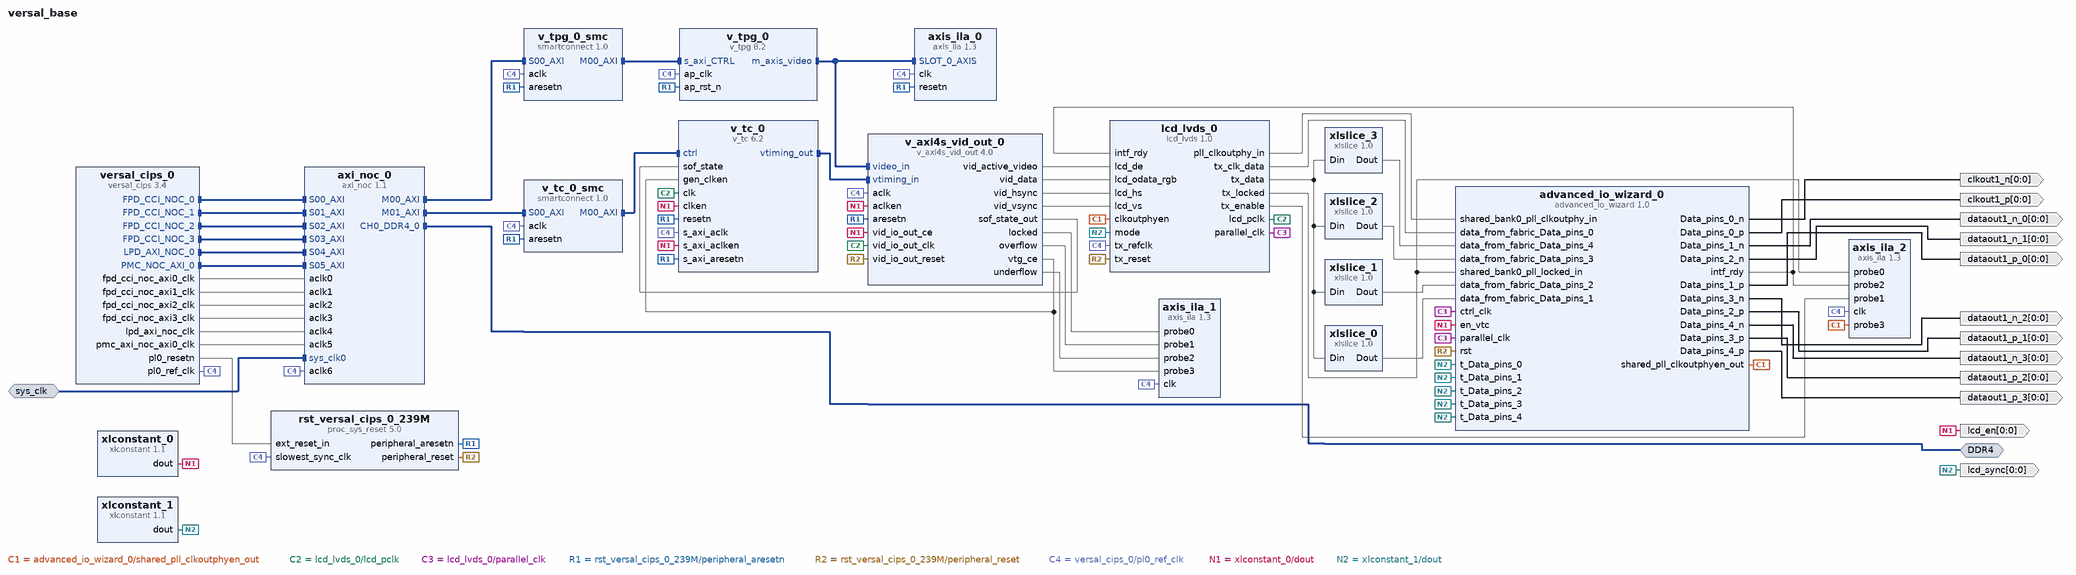
[diagram p0: block diagram of the top level]
# Vivado block design versal_base, xcve2302-sfva784-1LP-e-S, Vivado 2024.2
create_bd_design versal_base

create_bd_intf_port -mode Master -vlnv xilinx.com:interface:ddr4_rtl:1.0 DDR4
create_bd_intf_port -mode Slave -vlnv xilinx.com:interface:diff_clock_rtl:1.0 sys_clk
set_property -dict {CONFIG.FREQ_HZ 200000000} [get_bd_intf_ports sys_clk]
create_bd_port -dir O -from 0 -to 0 dataout1_n_0
create_bd_port -dir O -from 0 -to 0 dataout1_n_3
create_bd_port -dir O -from 0 -to 0 dataout1_p_0
create_bd_port -dir O -from 0 -to 0 dataout1_n_2
create_bd_port -dir O -from 0 -to 0 dataout1_p_3
create_bd_port -dir O -from 0 -to 0 dataout1_p_2
create_bd_port -dir O -from 0 -to 0 clkout1_n
create_bd_port -dir O -from 0 -to 0 clkout1_p
create_bd_port -dir O -from 0 -to 0 dataout1_n_1
create_bd_port -dir O -from 0 -to 0 dataout1_p_1
create_bd_port -dir O -from 0 -to 0 lcd_en
create_bd_port -dir O -from 0 -to 0 lcd_sync

create_bd_cell -type ip -vlnv xilinx.com:ip:versal_cips:3.4 versal_cips_0
set_property -dict [list \
  CONFIG.BOOT_MODE Custom \
  CONFIG.CLOCK_MODE Custom \
  CONFIG.DDR_MEMORY_MODE Enable \
  CONFIG.DESIGN_MODE 1 \
  CONFIG.IO_CONFIG_MODE Custom \
  CONFIG.PS_PMC_CONFIG {['BOOT_MODE Custom', 'CLOCK_MODE Custom', 'DDR_MEMORY_MODE {Connectivity to DDR via NOC}', 'IO_CONFIG_MODE Custom', 'PMC_CRP_PL0_REF_CTRL_FREQMHZ 200', 'PMC_QSPI_FBCLK {{ENABLE 1} {IO {PMC_MIO 6}}}', 'PMC_QSPI_PERIPHERAL_DATA_MODE x4', 'PMC_QSPI_PERIPHERAL_ENABLE 1', 'PMC_QSPI_PERIPHERAL_MODE {Dual Parallel}', 'PMC_SD0 {{CD_ENABLE 0} {CD_IO {PMC_MIO 24}} {POW_ENABLE 0} {POW_IO {PMC_MIO 17}} {RESET_ENABLE 1} {RESET_IO {PMC_MIO 49}} {WP_ENABLE 0} {WP_IO {PMC_MIO 25}}}', 'PMC_SD0_DATA_TRANSFER_MODE 8Bit', 'PMC_SD0_PERIPHERAL {{CLK_100_SDR_OTAP_DLY 0x00} {CLK_200_SDR_OTAP_DLY 0x2} {CLK_50_DDR_ITAP_DLY 0x1E} {CLK_50_DDR_OTAP_DLY 0x5} {CLK_50_SDR_ITAP_DLY 0x2C} {CLK_50_SDR_OTAP_DLY 0x5} {ENABLE 1} {IO {PMC_MIO 37 .. 49}}}', 'PMC_SD0_SLOT_TYPE eMMC', 'PMC_SD1 {{CD_ENABLE 1} {CD_IO {PMC_MIO 28}} {POW_ENABLE 0} {POW_IO {PMC_MIO 12}} {RESET_ENABLE 0} {RESET_IO {PMC_MIO 12}} {WP_ENABLE 0} {WP_IO {PMC_MIO 1}}}', 'PMC_SD1_PERIPHERAL {{CLK_100_SDR_OTAP_DLY 0x00} {CLK_200_SDR_OTAP_DLY 0x00} {CLK_50_DDR_ITAP_DLY 0x00} {CLK_50_DDR_OTAP_DLY 0x00} {CLK_50_SDR_ITAP_DLY 0x2C} {CLK_50_SDR_OTAP_DLY 0x4} {ENABLE 1} {IO {PMC_MIO 26 .. 36}}}', 'PMC_USE_PMC_NOC_AXI0 1', 'PS_ENET0_MDIO {{ENABLE 1} {IO {PMC_MIO 50 .. 51}}}', 'PS_ENET0_PERIPHERAL {{ENABLE 1} {IO {PS_MIO 0 .. 11}}}', 'PS_GEN_IPI0_ENABLE 1', 'PS_GEN_IPI1_ENABLE 1', 'PS_GEN_IPI2_ENABLE 1', 'PS_GEN_IPI3_ENABLE 1', 'PS_GEN_IPI4_ENABLE 1', 'PS_GEN_IPI5_ENABLE 1', 'PS_GEN_IPI6_ENABLE 1', 'PS_GPIO_EMIO_PERIPHERAL_ENABLE 1', 'PS_MIO24 {{AUX_IO 0} {DIRECTION in} {DRIVE_STRENGTH 8mA} {OUTPUT_DATA default} {PULL pullup} {SCHMITT 0} {SLEW slow} {USAGE GPIO}}', 'PS_MIO25 {{AUX_IO 0} {DIRECTION out} {DRIVE_STRENGTH 8mA} {OUTPUT_DATA default} {PULL pullup} {SCHMITT 0} {SLEW slow} {USAGE GPIO}}', 'PS_NUM_FABRIC_RESETS 1', 'PS_TTC0_PERIPHERAL_ENABLE 1', 'PS_TTC1_PERIPHERAL_ENABLE 1', 'PS_TTC2_PERIPHERAL_ENABLE 1', 'PS_TTC3_PERIPHERAL_ENABLE 1', 'PS_UART0_PERIPHERAL {{ENABLE 1} {IO {PS_MIO 16 .. 17}}}', 'PS_USB3_PERIPHERAL {{ENABLE 1} {IO {PMC_MIO 13 .. 25}}}', 'PS_USE_FPD_CCI_NOC 1', 'PS_USE_FPD_CCI_NOC0 1', 'PS_USE_NOC_LPD_AXI0 1', 'PS_USE_PMCPL_CLK0 1', 'SMON_ALARMS Set_Alarms_On', 'SMON_ENABLE_TEMP_AVERAGING 0', 'SMON_TEMP_AVERAGING_SAMPLES 0']} \
] [get_bd_cells versal_cips_0]
create_bd_cell -type ip -vlnv xilinx.com:ip:axi_noc:1.1 axi_noc_0
set_property -dict [list \
  CONFIG.CONTROLLERTYPE DDR4_SDRAM \
  CONFIG.MC_CHAN_REGION1 NONE \
  CONFIG.MC_COMPONENT_WIDTH x16 \
  CONFIG.MC_INPUTCLK0_PERIOD 5000 \
  CONFIG.MC_MEMORY_SPEEDGRADE {DDR4-3200AA(22-22-22)} \
  CONFIG.MI_SIDEBAND_PINS 0 \
  CONFIG.NUM_CLKS 7 \
  CONFIG.NUM_MC 1 \
  CONFIG.NUM_MCP 4 \
  CONFIG.NUM_MI 2 \
  CONFIG.NUM_SI 6 \
] [get_bd_cells axi_noc_0]
create_bd_cell -type ip -vlnv xilinx.com:ip:v_tpg:8.2 v_tpg_0
create_bd_cell -type ip -vlnv xilinx.com:ip:smartconnect:1.0 v_tpg_0_smc
set_property -dict {CONFIG.NUM_MI 1 CONFIG.NUM_SI 1} [get_bd_cells v_tpg_0_smc]
create_bd_cell -type ip -vlnv xilinx.com:ip:proc_sys_reset:5.0 rst_versal_cips_0_239M
create_bd_cell -type ip -vlnv xilinx.com:ip:axis_ila:1.3 axis_ila_0
set_property -dict [list \
  CONFIG.C_MON_TYPE Interface_Monitor \
  CONFIG.C_SLOT_0_INTF_TYPE xilinx.com:interface:axis_rtl:1.0 \
] [get_bd_cells axis_ila_0]
create_bd_cell -type ip -vlnv xilinx.com:ip:v_axi4s_vid_out:4.0 v_axi4s_vid_out_0
set_property -dict {CONFIG.C_HAS_ASYNC_CLK 1 CONFIG.C_VTG_MASTER_SLAVE 1} [get_bd_cells v_axi4s_vid_out_0]
create_bd_cell -type ip -vlnv xilinx.com:ip:v_tc:6.2 v_tc_0
set_property -dict {CONFIG.enable_detection false} [get_bd_cells v_tc_0]
create_bd_cell -type ip -vlnv xilinx.com:ip:xlconstant:1.1 xlconstant_0
create_bd_cell -type ip -vlnv xilinx.com:ip:axis_ila:1.3 axis_ila_1
set_property -dict {CONFIG.C_NUM_OF_PROBES 4} [get_bd_cells axis_ila_1]
create_bd_cell -type ip -vlnv xilinx.com:ip:smartconnect:1.0 v_tc_0_smc
set_property -dict {CONFIG.NUM_MI 1 CONFIG.NUM_SI 1} [get_bd_cells v_tc_0_smc]
create_bd_cell -type ip -vlnv user.org:user:lcd_lvds:1.0 lcd_lvds_0
create_bd_cell -type ip -vlnv xilinx.com:ip:xlconstant:1.1 xlconstant_1
set_property -dict {CONFIG.CONST_VAL 0} [get_bd_cells xlconstant_1]
create_bd_cell -type ip -vlnv xilinx.com:ip:advanced_io_wizard:1.0 advanced_io_wizard_0
set_property -dict [list \
  CONFIG.BUS0_IO_TYPE DIFF \
  CONFIG.BUS0_SIG_TYPE {Clk Fwd} \
  CONFIG.BUS1_DIR TX \
  CONFIG.BUS1_IO_TYPE DIFF \
  CONFIG.BUS2_DIR TX \
  CONFIG.BUS2_IO_TYPE DIFF \
  CONFIG.BUS3_DIR TX \
  CONFIG.BUS3_IO_TYPE DIFF \
  CONFIG.BUS4_DIR TX \
  CONFIG.BUS4_IO_TYPE DIFF \
  CONFIG.BUS_DIR 0 \
  CONFIG.DATA_SPEED 700.00 \
  CONFIG.DIFF_IO_STD DIFF_SSTL12 \
  CONFIG.INPUT_CLK_FREQ 200.000 \
  CONFIG.PLL_IN_CORE 0 \
  CONFIG.TX_SERIALIZATION_FACTOR 4 \
] [get_bd_cells advanced_io_wizard_0]
create_bd_cell -type ip -vlnv xilinx.com:ip:xlslice:1.0 xlslice_0
set_property -dict {CONFIG.DIN_FROM 3 CONFIG.DIN_WIDTH 16} [get_bd_cells xlslice_0]
create_bd_cell -type ip -vlnv xilinx.com:ip:xlslice:1.0 xlslice_1
set_property -dict {CONFIG.DIN_FROM 7 CONFIG.DIN_TO 4 CONFIG.DIN_WIDTH 16} [get_bd_cells xlslice_1]
create_bd_cell -type ip -vlnv xilinx.com:ip:xlslice:1.0 xlslice_2
set_property -dict {CONFIG.DIN_FROM 11 CONFIG.DIN_TO 8 CONFIG.DIN_WIDTH 16} [get_bd_cells xlslice_2]
create_bd_cell -type ip -vlnv xilinx.com:ip:xlslice:1.0 xlslice_3
set_property -dict {CONFIG.DIN_FROM 15 CONFIG.DIN_TO 12 CONFIG.DIN_WIDTH 16} [get_bd_cells xlslice_3]
create_bd_cell -type ip -vlnv xilinx.com:ip:axis_ila:1.3 axis_ila_2
set_property -dict {CONFIG.C_NUM_OF_PROBES 4} [get_bd_cells axis_ila_2]

# ---- connections ----

connect_bd_intf_net [get_bd_intf_ports DDR4] [get_bd_intf_pins axi_noc_0/CH0_DDR4_0]
connect_bd_intf_net [get_bd_intf_pins v_tpg_0_smc/S00_AXI] [get_bd_intf_pins axi_noc_0/M00_AXI]
connect_bd_intf_net [get_bd_intf_pins v_tc_0_smc/S00_AXI] [get_bd_intf_pins axi_noc_0/M01_AXI]
connect_bd_intf_net -intf_net sys_clk0_0_1 [get_bd_intf_ports sys_clk] [get_bd_intf_pins axi_noc_0/sys_clk0]
connect_bd_intf_net [get_bd_intf_pins v_tc_0/ctrl] [get_bd_intf_pins v_tc_0_smc/M00_AXI]
connect_bd_intf_net [get_bd_intf_pins v_tc_0/vtiming_out] [get_bd_intf_pins v_axi4s_vid_out_0/vtiming_in]
connect_bd_intf_net [get_bd_intf_pins v_tpg_0/m_axis_video] [get_bd_intf_pins v_axi4s_vid_out_0/video_in]
connect_bd_intf_net [get_bd_intf_pins v_tpg_0/m_axis_video] [get_bd_intf_pins axis_ila_0/SLOT_0_AXIS]
connect_bd_intf_net [get_bd_intf_pins v_tpg_0/s_axi_CTRL] [get_bd_intf_pins v_tpg_0_smc/M00_AXI]
connect_bd_intf_net [get_bd_intf_pins versal_cips_0/FPD_CCI_NOC_0] [get_bd_intf_pins axi_noc_0/S00_AXI]
connect_bd_intf_net [get_bd_intf_pins versal_cips_0/FPD_CCI_NOC_1] [get_bd_intf_pins axi_noc_0/S01_AXI]
connect_bd_intf_net [get_bd_intf_pins versal_cips_0/FPD_CCI_NOC_2] [get_bd_intf_pins axi_noc_0/S02_AXI]
connect_bd_intf_net [get_bd_intf_pins versal_cips_0/FPD_CCI_NOC_3] [get_bd_intf_pins axi_noc_0/S03_AXI]
connect_bd_intf_net [get_bd_intf_pins versal_cips_0/LPD_AXI_NOC_0] [get_bd_intf_pins axi_noc_0/S04_AXI]
connect_bd_intf_net [get_bd_intf_pins versal_cips_0/PMC_NOC_AXI_0] [get_bd_intf_pins axi_noc_0/S05_AXI]
connect_bd_net [get_bd_pins advanced_io_wizard_0/Data_pins_0_n] [get_bd_ports clkout1_n]
connect_bd_net [get_bd_pins advanced_io_wizard_0/Data_pins_0_p] [get_bd_ports clkout1_p]
connect_bd_net [get_bd_pins advanced_io_wizard_0/Data_pins_1_n] [get_bd_ports dataout1_n_0]
connect_bd_net [get_bd_pins advanced_io_wizard_0/Data_pins_1_p] [get_bd_ports dataout1_p_0]
connect_bd_net [get_bd_pins advanced_io_wizard_0/Data_pins_2_n] [get_bd_ports dataout1_n_1]
connect_bd_net [get_bd_pins advanced_io_wizard_0/Data_pins_2_p] [get_bd_ports dataout1_p_1]
connect_bd_net [get_bd_pins advanced_io_wizard_0/Data_pins_3_n] [get_bd_ports dataout1_n_2]
connect_bd_net [get_bd_pins advanced_io_wizard_0/Data_pins_3_p] [get_bd_ports dataout1_p_2]
connect_bd_net [get_bd_pins advanced_io_wizard_0/Data_pins_4_n] [get_bd_ports dataout1_n_3]
connect_bd_net [get_bd_pins advanced_io_wizard_0/Data_pins_4_p] [get_bd_ports dataout1_p_3]
connect_bd_net [get_bd_pins advanced_io_wizard_0/intf_rdy] [get_bd_pins lcd_lvds_0/intf_rdy] [get_bd_pins axis_ila_2/probe2]
connect_bd_net [get_bd_pins advanced_io_wizard_0/shared_pll_clkoutphyen_out] [get_bd_pins lcd_lvds_0/clkoutphyen] [get_bd_pins axis_ila_2/probe3]
connect_bd_net [get_bd_pins lcd_lvds_0/lcd_pclk] [get_bd_pins v_axi4s_vid_out_0/vid_io_out_clk] [get_bd_pins v_tc_0/clk]
connect_bd_net [get_bd_pins lcd_lvds_0/parallel_clk] [get_bd_pins advanced_io_wizard_0/ctrl_clk] [get_bd_pins advanced_io_wizard_0/parallel_clk]
connect_bd_net [get_bd_pins lcd_lvds_0/pll_clkoutphy_in] [get_bd_pins advanced_io_wizard_0/shared_bank0_pll_clkoutphy_in]
connect_bd_net [get_bd_pins lcd_lvds_0/tx_clk_data] [get_bd_pins advanced_io_wizard_0/data_from_fabric_Data_pins_0]
connect_bd_net [get_bd_pins lcd_lvds_0/tx_data] \
  [get_bd_pins xlslice_0/Din] [get_bd_pins xlslice_1/Din] [get_bd_pins xlslice_2/Din] [get_bd_pins xlslice_3/Din]
connect_bd_net [get_bd_pins lcd_lvds_0/tx_enable] [get_bd_pins axis_ila_2/probe1]
connect_bd_net [get_bd_pins lcd_lvds_0/tx_locked] [get_bd_pins advanced_io_wizard_0/shared_bank0_pll_locked_in] [get_bd_pins axis_ila_2/probe0]
connect_bd_net [get_bd_pins rst_versal_cips_0_239M/peripheral_aresetn] \
  [get_bd_pins v_tpg_0/ap_rst_n] [get_bd_pins v_tpg_0_smc/aresetn] [get_bd_pins axis_ila_0/resetn] \
  [get_bd_pins v_tc_0/s_axi_aresetn] [get_bd_pins v_axi4s_vid_out_0/aresetn] [get_bd_pins v_tc_0_smc/aresetn] \
  [get_bd_pins v_tc_0/resetn]
connect_bd_net [get_bd_pins rst_versal_cips_0_239M/peripheral_reset] \
  [get_bd_pins v_axi4s_vid_out_0/vid_io_out_reset] [get_bd_pins lcd_lvds_0/tx_reset] [get_bd_pins advanced_io_wizard_0/rst]
connect_bd_net [get_bd_pins v_axi4s_vid_out_0/locked] [get_bd_pins axis_ila_1/probe0]
connect_bd_net [get_bd_pins v_axi4s_vid_out_0/overflow] [get_bd_pins axis_ila_1/probe1]
connect_bd_net [get_bd_pins v_axi4s_vid_out_0/sof_state_out] [get_bd_pins v_tc_0/sof_state]
connect_bd_net [get_bd_pins v_axi4s_vid_out_0/underflow] [get_bd_pins axis_ila_1/probe2]
connect_bd_net [get_bd_pins v_axi4s_vid_out_0/vid_active_video] [get_bd_pins lcd_lvds_0/lcd_de]
connect_bd_net [get_bd_pins v_axi4s_vid_out_0/vid_data] [get_bd_pins lcd_lvds_0/lcd_odata_rgb]
connect_bd_net [get_bd_pins v_axi4s_vid_out_0/vid_hsync] [get_bd_pins lcd_lvds_0/lcd_hs]
connect_bd_net [get_bd_pins v_axi4s_vid_out_0/vid_vsync] [get_bd_pins lcd_lvds_0/lcd_vs]
connect_bd_net [get_bd_pins v_axi4s_vid_out_0/vtg_ce] [get_bd_pins axis_ila_1/probe3] [get_bd_pins v_tc_0/gen_clken]
connect_bd_net [get_bd_pins versal_cips_0/fpd_cci_noc_axi0_clk] [get_bd_pins axi_noc_0/aclk0]
connect_bd_net [get_bd_pins versal_cips_0/fpd_cci_noc_axi1_clk] [get_bd_pins axi_noc_0/aclk1]
connect_bd_net [get_bd_pins versal_cips_0/fpd_cci_noc_axi2_clk] [get_bd_pins axi_noc_0/aclk2]
connect_bd_net [get_bd_pins versal_cips_0/fpd_cci_noc_axi3_clk] [get_bd_pins axi_noc_0/aclk3]
connect_bd_net [get_bd_pins versal_cips_0/lpd_axi_noc_clk] [get_bd_pins axi_noc_0/aclk4]
connect_bd_net [get_bd_pins versal_cips_0/pl0_ref_clk] \
  [get_bd_pins v_tpg_0/ap_clk] [get_bd_pins axi_noc_0/aclk6] [get_bd_pins rst_versal_cips_0_239M/slowest_sync_clk] \
  [get_bd_pins v_tpg_0_smc/aclk] [get_bd_pins axis_ila_0/clk] [get_bd_pins v_tc_0/s_axi_aclk] \
  [get_bd_pins v_axi4s_vid_out_0/aclk] [get_bd_pins axis_ila_1/clk] [get_bd_pins v_tc_0_smc/aclk] \
  [get_bd_pins lcd_lvds_0/tx_refclk] [get_bd_pins axis_ila_2/clk]
connect_bd_net [get_bd_pins versal_cips_0/pl0_resetn] [get_bd_pins rst_versal_cips_0_239M/ext_reset_in]
connect_bd_net [get_bd_pins versal_cips_0/pmc_axi_noc_axi0_clk] [get_bd_pins axi_noc_0/aclk5]
connect_bd_net [get_bd_pins xlconstant_0/dout] \
  [get_bd_pins v_tc_0/clken] [get_bd_pins v_tc_0/s_axi_aclken] [get_bd_pins v_axi4s_vid_out_0/aclken] \
  [get_bd_pins v_axi4s_vid_out_0/vid_io_out_ce] [get_bd_pins advanced_io_wizard_0/en_vtc] [get_bd_ports lcd_en]
connect_bd_net [get_bd_pins xlconstant_1/dout] \
  [get_bd_pins lcd_lvds_0/mode] [get_bd_pins advanced_io_wizard_0/t_Data_pins_0] \
  [get_bd_pins advanced_io_wizard_0/t_Data_pins_1] [get_bd_pins advanced_io_wizard_0/t_Data_pins_2] \
  [get_bd_pins advanced_io_wizard_0/t_Data_pins_3] [get_bd_pins advanced_io_wizard_0/t_Data_pins_4] [get_bd_ports lcd_sync]
connect_bd_net [get_bd_pins xlslice_0/Dout] [get_bd_pins advanced_io_wizard_0/data_from_fabric_Data_pins_1]
connect_bd_net [get_bd_pins xlslice_1/Dout] [get_bd_pins advanced_io_wizard_0/data_from_fabric_Data_pins_2]
connect_bd_net [get_bd_pins xlslice_2/Dout] [get_bd_pins advanced_io_wizard_0/data_from_fabric_Data_pins_3]
connect_bd_net [get_bd_pins xlslice_3/Dout] [get_bd_pins advanced_io_wizard_0/data_from_fabric_Data_pins_4]

# ---- address map ----
assign_bd_address -offset 0x0000000000000000 -range 2G -target_address_space [get_bd_addr_spaces versal_cips_0/FPD_CCI_NOC_0] [get_bd_addr_segs axi_noc_0/S00_AXI/C3_DDR_LOW0]
assign_bd_address -offset 0x0000020100000000 -range 64K -target_address_space [get_bd_addr_spaces versal_cips_0/FPD_CCI_NOC_0] [get_bd_addr_segs v_tpg_0/s_axi_CTRL/Reg]
assign_bd_address -offset 0x0000020180000000 -range 64K -target_address_space [get_bd_addr_spaces versal_cips_0/FPD_CCI_NOC_0] [get_bd_addr_segs v_tc_0/ctrl/Reg]
assign_bd_address -offset 0x0000000000000000 -range 2G -target_address_space [get_bd_addr_spaces versal_cips_0/FPD_CCI_NOC_1] [get_bd_addr_segs axi_noc_0/S01_AXI/C2_DDR_LOW0]
assign_bd_address -offset 0x0000000000000000 -range 2G -target_address_space [get_bd_addr_spaces versal_cips_0/FPD_CCI_NOC_2] [get_bd_addr_segs axi_noc_0/S02_AXI/C0_DDR_LOW0]
assign_bd_address -offset 0x0000000000000000 -range 2G -target_address_space [get_bd_addr_spaces versal_cips_0/FPD_CCI_NOC_3] [get_bd_addr_segs axi_noc_0/S03_AXI/C1_DDR_LOW0]
assign_bd_address -offset 0x0000000000000000 -range 2G -target_address_space [get_bd_addr_spaces versal_cips_0/LPD_AXI_NOC_0] [get_bd_addr_segs axi_noc_0/S04_AXI/C3_DDR_LOW0]
assign_bd_address -offset 0x0000000000000000 -range 2G -target_address_space [get_bd_addr_spaces versal_cips_0/PMC_NOC_AXI_0] [get_bd_addr_segs axi_noc_0/S05_AXI/C2_DDR_LOW0]

validate_bd_design
save_bd_design
